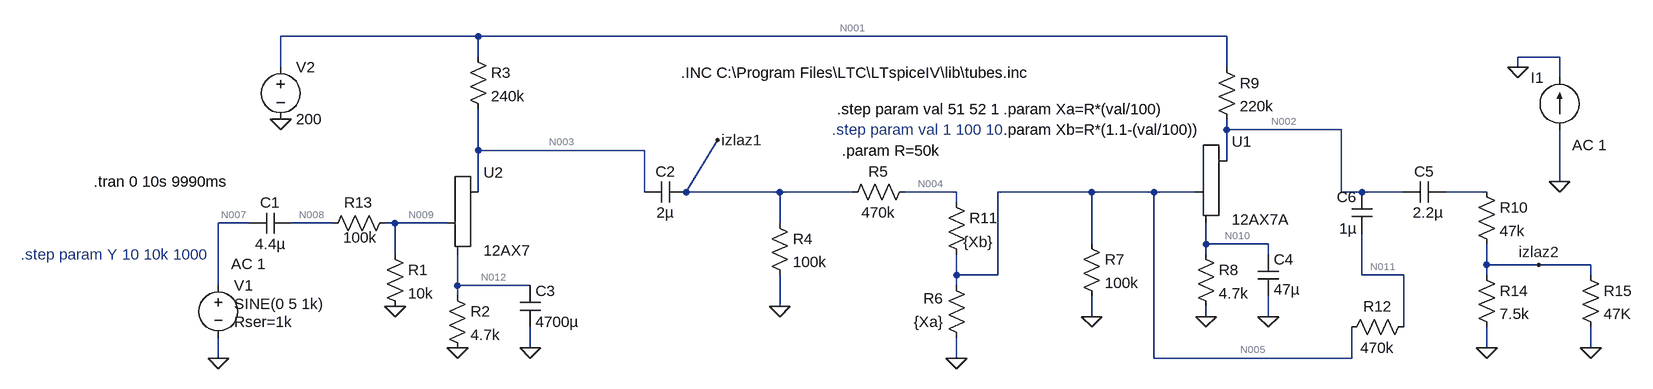
[diagram p0: schematic tube.asc]
tube.asc, the LTspice schematic file:
Version 4
SHEET 1 1832 832
WIRE -240 32 -544 32
WIRE 912 32 -240 32
WIRE -240 64 -240 32
WIRE 1424 64 1360 64
WIRE -544 80 -544 32
WIRE 912 80 912 32
WIRE 1360 80 1360 64
WIRE 1424 96 1424 64
WIRE 912 176 912 160
WIRE 1088 176 912 176
WIRE -240 208 -240 144
WIRE 16 208 -240 208
WIRE 912 224 912 176
WIRE 1424 256 1424 176
WIRE -240 272 -240 208
WIRE 16 272 16 208
WIRE 80 272 128 192
WIRE 80 272 64 272
WIRE 224 272 80 272
WIRE 336 272 224 272
WIRE 496 272 416 272
WIRE 704 272 560 272
WIRE 800 272 704 272
WIRE 864 272 800 272
WIRE 1088 272 1088 176
WIRE 1120 272 1088 272
WIRE 1184 272 1120 272
WIRE 1312 272 1248 272
WIRE 496 288 496 272
WIRE -592 320 -640 320
WIRE -464 320 -528 320
WIRE -368 320 -384 320
WIRE -288 320 -368 320
WIRE 224 320 224 272
WIRE 704 352 704 272
WIRE 880 352 880 320
WIRE 976 352 880 352
WIRE -368 368 -368 320
WIRE 880 368 880 352
WIRE 976 368 976 352
WIRE 1312 384 1312 352
WIRE 1392 384 1312 384
WIRE 1472 384 1392 384
WIRE 496 400 496 368
WIRE 560 400 560 272
WIRE 560 400 496 400
WIRE 1120 400 1120 336
WIRE 1184 400 1120 400
WIRE 1312 400 1312 384
WIRE 1472 400 1472 384
WIRE -640 416 -640 320
WIRE -272 416 -272 368
WIRE -160 416 -272 416
WIRE 496 416 496 400
WIRE -272 432 -272 416
WIRE 224 448 224 400
WIRE 704 464 704 432
WIRE 880 464 880 448
WIRE 976 464 976 432
WIRE 1184 480 1184 400
WIRE -160 512 -160 480
WIRE 1312 512 1312 480
WIRE 1472 512 1472 480
WIRE -640 528 -640 496
WIRE 496 528 496 496
WIRE 800 528 800 272
WIRE 1104 528 1104 480
WIRE 1104 528 800 528
FLAG -640 528 0
FLAG -544 160 0
FLAG -272 512 0
FLAG -368 448 0
FLAG -160 512 0
FLAG 128 192 izlaz1
FLAG 496 528 0
FLAG 704 464 0
FLAG 880 464 0
FLAG 976 464 0
FLAG 1312 512 0
FLAG 1392 384 izlaz2
FLAG 224 448 0
FLAG 1424 256 0
FLAG 1360 80 0
FLAG 1472 512 0
SYMBOL voltage -640 400 R0
WINDOW 3 24 44 Left 2
WINDOW 123 20 -17 Left 2
WINDOW 39 24 72 Left 2
SYMATTR Value SINE(0 5 1k)
SYMATTR Value2 AC 1
SYMATTR SpiceLine Rser=1k
SYMATTR InstName V1
SYMBOL Misc\\triode -240 320 R0
SYMATTR InstName U2
SYMATTR Value 12AX7
SYMBOL cap -528 304 R90
WINDOW 0 0 32 VBottom 2
WINDOW 3 32 32 VTop 2
SYMATTR InstName C1
SYMATTR Value 4.4µ
SYMBOL cap 80 256 R90
WINDOW 0 0 32 VBottom 2
WINDOW 3 32 32 VTop 2
SYMATTR InstName C2
SYMATTR Value 2µ
SYMBOL res -384 352 R0
SYMATTR InstName R1
SYMATTR Value 10k
SYMATTR SpiceLine tol=1 pwr=0.25
SYMBOL res -288 416 R0
SYMATTR InstName R2
SYMATTR Value 4.7k
SYMATTR SpiceLine tol=1 pwr=0.25
SYMBOL res -256 48 R0
SYMATTR InstName R3
SYMATTR Value 240k
SYMATTR SpiceLine tol=1 pwr=0.25
SYMBOL res 208 304 R0
SYMATTR InstName R4
SYMATTR Value 100k
SYMATTR SpiceLine tol=1 pwr=0.25
SYMBOL voltage -544 64 R0
WINDOW 123 0 0 Left 2
WINDOW 39 0 0 Left 2
SYMATTR InstName V2
SYMATTR Value 200
SYMBOL cap -176 416 R0
SYMATTR InstName C3
SYMATTR Value 4700µ
SYMBOL res 512 512 R180
WINDOW 0 36 76 Left 2
WINDOW 3 36 40 Left 2
SYMATTR InstName R6
SYMATTR Value {Xa}
SYMBOL res 688 336 R0
SYMATTR InstName R7
SYMATTR Value 100k
SYMBOL Misc\\triode 912 272 R0
SYMATTR InstName U1
SYMATTR Value 12AX7A
SYMBOL res 864 352 R0
SYMATTR InstName R8
SYMATTR Value 4.7k
SYMATTR SpiceLine tol=1 pwr=0.6
SYMBOL cap 1248 256 R90
WINDOW 0 0 32 VBottom 2
WINDOW 3 32 26 VTop 2
SYMATTR InstName C5
SYMATTR Value 2.2µ
SYMBOL res 896 64 R0
SYMATTR InstName R9
SYMATTR Value 220k
SYMBOL cap 1136 336 R180
WINDOW 0 24 56 Left 2
WINDOW 3 24 8 Left 2
SYMATTR InstName C6
SYMATTR Value 1µ
SYMBOL res 1296 256 R0
SYMATTR InstName R10
SYMATTR Value 47k
SYMBOL res 480 272 R0
WINDOW 3 27 77 Left 2
SYMATTR Value {Xb}
SYMATTR InstName R11
SYMBOL res 432 256 R90
WINDOW 0 0 56 VBottom 2
WINDOW 3 32 56 VTop 2
SYMATTR InstName R5
SYMATTR Value 470k
SYMBOL res 1200 464 R90
WINDOW 0 0 56 VBottom 2
WINDOW 3 32 56 VTop 2
SYMATTR InstName R12
SYMATTR Value 470k
SYMBOL current 1424 176 R180
WINDOW 0 24 80 Left 2
WINDOW 3 24 0 Left 2
WINDOW 123 -73 -24 Left 2
WINDOW 39 0 0 Left 2
SYMATTR InstName I1
SYMATTR Value ""
SYMATTR Value2 AC 1
SYMBOL res -368 304 R90
WINDOW 0 0 56 VBottom 2
WINDOW 3 22 54 VTop 2
SYMATTR InstName R13
SYMATTR Value 100k
SYMBOL res 1296 384 R0
SYMATTR InstName R14
SYMATTR Value 7.5k
SYMBOL cap 960 368 R0
WINDOW 3 24 54 Left 2
SYMATTR Value 47µ
SYMATTR InstName C4
SYMBOL res 1456 384 R0
SYMATTR InstName R15
SYMATTR Value 47K
TEXT 72 88 Left 2 !.INC C:\\Program Files\\LTC\\LTspiceIV\\lib\\tubes.inc
TEXT -832 256 Left 2 !.tran 0 10s 9990ms
TEXT 304 176 Left 2 ;.step param val 1 100 10
TEXT 568 144 Left 2 !.param Xa=R*(val/100)
TEXT 568 176 Left 2 !.param Xb=R*(1.1-(val/100))
TEXT 320 208 Left 2 !.param R=50k
TEXT -944 368 Left 2 ;.step param Y 10 10k 1000
TEXT 312 144 Left 2 !.step param val 51 52 1

The netlist it stands for:
* tube.asc
V1 N007 0 SINE(0 5 1k) AC 1 Rser=1k
XU2 N003 N009 N012 12AX7
C1 N008 N007 4.4µ
C2 izlaz1 N003 2µ
R1 N009 0 10k tol=1 pwr=0.25
R2 N012 0 4.7k tol=1 pwr=0.25
R3 N001 N003 240k tol=1 pwr=0.25
R4 izlaz1 0 100k tol=1 pwr=0.25
V2 N001 0 200
C3 N012 0 4700µ
R6 0 N005 {Xa}
R7 N005 0 100k
XU1 N002 N005 N010 12AX7A
R8 N010 0 4.7k tol=1 pwr=0.6
C5 N006 N002 2.2µ
R9 N001 N002 220k
C6 N011 N002 1µ
R10 N006 izlaz2 47k
R11 N004 N005 {Xb}
R5 N004 izlaz1 470k
R12 N011 N005 470k
I1 0 0 AC 1
R13 N009 N008 100k
R14 izlaz2 0 7.5k
C4 N010 0 47µ
R15 izlaz2 0 47K
.INC C:\Program Files\LTC\LTspiceIV\lib\tubes.inc
.tran 0 10s 9990ms
* .step param val 1 100 10
.param Xa=R*(val/100)
.param Xb=R*(1.1-(val/100))
.param R=50k
* .step param Y 10 10k 1000
.step param val 51 52 1
.backanno
.end

* Results of the author's LTspice run, read from the files saved beside the schematic
* Operating Point (first step), zero values left out:
*   val = 51 
*   V(n003) = 137.5 V
*   V(n012) = 1.225 V
*   V(n009) = 10.01 µV
*   V(n008) = 10.01 µV
*   V(izlaz1) = 3.283 µV
*   V(n001) = 200 V
*   V(n005) = 19.68 µV
*   V(n002) = 132.3 V
*   V(n010) = 1.446 V
*   V(n011) = 19.68 µV
*   V(n004) = 18.71 µV
*   I(R5) = 32.83 pA
*   I(R11) = -32.83 pA
*   I(R9) = 307.6 µA
*   I(R8) = 307.6 µA
*   I(R7) = 196.8 pA
*   I(R6) = -771.8 pA
*   I(R4) = 32.83 pA
*   I(R3) = 260.5 µA
*   I(R2) = 260.5 µA
*   I(R1) = 1.001 nA
*   I(V2) = -568.1 µA
*   Ix(u2:1) = 260.5 µA
*   Ix(u2:2) = -1.001 nA
*   Ix(u2:3) = -260.5 µA
*   Ix(u1:1) = 307.6 µA
*   Ix(u1:2) = -1.001 nA
*   Ix(u1:3) = -307.6 µA
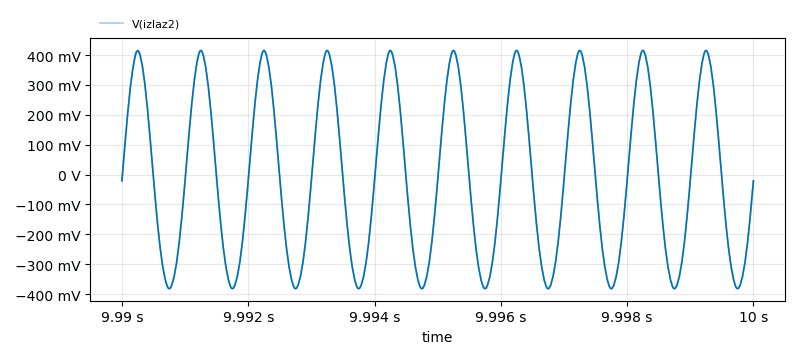
[diagram p1: Transient Analysis of tube.asc, plotted from the saved traces]
* Transient Analysis, 3 runs:
*   V(izlaz2) [run 1]: min -379.6 mV, max 412.6 mV, average -156.9 µV, rms 278.9 mV, last -20.67 mV
*   V(izlaz2) [run 2]: -20.97 mV at time=9.99 s, -20.97 mV at time=9.99 s, min -20.97 mV, max -20.97 mV
*   V(izlaz2) [run 3]: min -382.3 mV, max 415.5 mV, average -162.3 µV, rms 281 mV, last -20.84 mV
* From the log:
*   N-Period=1
*   Fourier components of V(izlaz2)
*   DC component:-0.000158586
*   Harmonic  Frequency   Fourier   Normalized   Phase    Normalized
*    Number     [Hz]     Component   Component  [degree]  Phase [deg]
*       1     1.000e+03  3.921e-01  1.000e+00     -0.46°      0.00°
*       2     2.000e+03  1.609e-02  4.104e-02    -91.42°    -90.96°
*       3     3.000e+03  1.318e-03  3.362e-03   -165.31°   -164.85°
*       4     4.000e+03  2.114e-04  5.392e-04    100.77°    101.23°
*       5     5.000e+03  1.409e-03  3.592e-03      9.71°     10.17°
*       6     6.000e+03  2.565e-04  6.542e-04    -72.59°    -72.13°
*       7     7.000e+03  7.310e-04  1.864e-03   -158.00°   -157.54°
*       8     8.000e+03  6.165e-05  1.572e-04     64.93°     65.39°
*       9     9.000e+03  3.427e-04  8.739e-04     14.27°     14.73°
*   Total Harmonic Distortion: 4.139502%(4.143870%)
*   N-Period=1
*   Fourier components of V(n007)
*   DC component:-2.74256e-005
*   Harmonic  Frequency   Fourier   Normalized   Phase    Normalized
*    Number     [Hz]     Component   Component  [degree]  Phase [deg]
*       1     1.000e+03  1.953e+00  1.000e+00      0.01°      0.00°
*       2     2.000e+03  5.507e-05  2.820e-05    -73.75°    -73.76°
*       3     3.000e+03  1.038e-02  5.315e-03   -172.44°   -172.45°
*       4     4.000e+03  5.392e-05  2.761e-05    -55.98°    -55.99°
*       5     5.000e+03  7.095e-03  3.633e-03     11.96°     11.94°
*       6     6.000e+03  5.166e-05  2.645e-05    -39.17°    -39.19°
*       7     7.000e+03  3.819e-03  1.955e-03   -162.04°   -162.05°
*       8     8.000e+03  4.864e-05  2.490e-05    -22.61°    -22.62°
*       9     9.000e+03  1.627e-03  8.328e-04     20.68°     20.67°
*   Total Harmonic Distortion: 0.677972%(0.701507%)
*   N-Period=1
*   Fourier components of V(izlaz2)
*   DC component:-0.000164191
*   Harmonic  Frequency   Fourier   Normalized   Phase    Normalized
*    Number     [Hz]     Component   Component  [degree]  Phase [deg]
*       1     1.000e+03  3.950e-01  1.000e+00     -0.46°      0.00°
*       2     2.000e+03  1.621e-02  4.105e-02    -91.43°    -90.96°
*       3     3.000e+03  1.327e-03  3.359e-03   -165.30°   -164.83°
*       4     4.000e+03  2.128e-04  5.387e-04    100.78°    101.25°
*       5     5.000e+03  1.419e-03  3.592e-03      9.71°     10.17°
*       6     6.000e+03  2.584e-04  6.542e-04    -72.59°    -72.13°
*       7     7.000e+03  7.363e-04  1.864e-03   -158.00°   -157.53°
*       8     8.000e+03  6.210e-05  1.572e-04     64.92°     65.38°
*       9     9.000e+03  3.452e-04  8.739e-04     14.26°     14.73°
*   Total Harmonic Distortion: 4.139973%(4.144340%)
*   N-Period=1
*   Fourier components of V(n007)
*   DC component:-2.74051e-005
*   Harmonic  Frequency   Fourier   Normalized   Phase    Normalized
*    Number     [Hz]     Component   Component  [degree]  Phase [deg]
*       1     1.000e+03  1.953e+00  1.000e+00      0.01°      0.00°
*       2     2.000e+03  5.507e-05  2.820e-05    -73.73°    -73.74°
*       3     3.000e+03  1.038e-02  5.315e-03   -172.44°   -172.45°
*       4     4.000e+03  5.393e-05  2.761e-05    -55.97°    -55.99°
*       5     5.000e+03  7.095e-03  3.633e-03     11.96°     11.94°
*       6     6.000e+03  5.164e-05  2.644e-05    -39.18°    -39.19°
*       7     7.000e+03  3.819e-03  1.955e-03   -162.04°   -162.05°
*       8     8.000e+03  4.865e-05  2.491e-05    -22.60°    -22.62°
*       9     9.000e+03  1.627e-03  8.328e-04     20.68°     20.67°
*   Total Harmonic Distortion: 0.677972%(0.701508%)